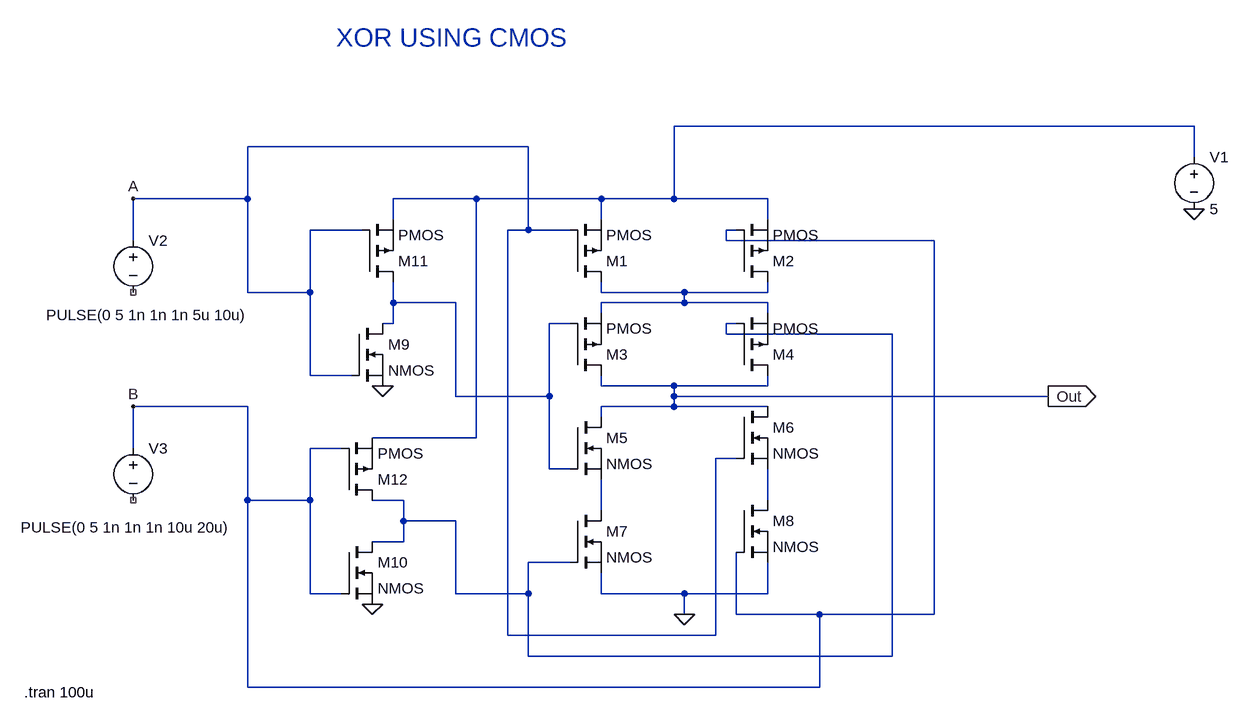
[diagram p0: schematic CMOS_XOR.asc]
CMOS_XOR.asc, the LTspice schematic file:
Version 4.1
SHEET 1 1224 744
WIRE 1168 -144 368 -144
WIRE 144 -112 -288 -112
WIRE 1168 -96 1168 -144
WIRE -288 -32 -288 -112
WIRE -288 -32 -464 -32
WIRE 64 -32 -64 -32
WIRE 256 -32 64 -32
WIRE 368 -32 368 -144
WIRE 368 -32 256 -32
WIRE 512 -32 368 -32
WIRE -64 0 -64 -32
WIRE 256 0 256 -32
WIRE 512 0 512 -32
WIRE -112 16 -192 16
WIRE 144 16 144 -112
WIRE 144 16 112 16
WIRE 208 16 144 16
WIRE 464 16 448 16
WIRE -464 32 -464 -32
WIRE 448 32 448 16
WIRE 768 32 448 32
WIRE -288 112 -288 -32
WIRE -192 112 -192 16
WIRE -192 112 -288 112
WIRE 256 112 256 96
WIRE 384 112 256 112
WIRE 512 112 512 96
WIRE 512 112 384 112
WIRE -64 128 -64 96
WIRE 32 128 -64 128
WIRE 384 128 384 112
WIRE 384 128 256 128
WIRE 512 128 384 128
WIRE 256 144 256 128
WIRE 512 144 512 128
WIRE -64 160 -64 128
WIRE -64 160 -80 160
WIRE 208 160 176 160
WIRE 464 160 448 160
WIRE 448 176 448 160
WIRE 704 176 448 176
WIRE -192 240 -192 112
WIRE -128 240 -192 240
WIRE 256 256 256 240
WIRE 368 256 256 256
WIRE 512 256 512 240
WIRE 512 256 368 256
WIRE 32 272 32 128
WIRE 176 272 176 160
WIRE 176 272 32 272
WIRE 368 272 368 256
WIRE 944 272 368 272
WIRE -288 288 -464 288
WIRE 368 288 368 272
WIRE 368 288 256 288
WIRE 512 288 368 288
WIRE 256 304 256 288
WIRE 64 336 64 -32
WIRE 64 336 -96 336
WIRE -464 352 -464 288
WIRE -144 352 -192 352
WIRE 464 368 432 368
WIRE 176 384 176 272
WIRE 208 384 176 384
WIRE -288 432 -288 288
WIRE -192 432 -192 352
WIRE -192 432 -288 432
WIRE -48 432 -96 432
WIRE 512 432 512 384
WIRE 256 448 256 400
WIRE -48 464 -48 432
WIRE 32 464 -48 464
WIRE -48 496 -48 464
WIRE -48 496 -96 496
WIRE 208 528 144 528
WIRE -192 576 -192 432
WIRE -144 576 -192 576
WIRE 32 576 32 464
WIRE 144 576 144 528
WIRE 144 576 32 576
WIRE 256 576 256 544
WIRE 384 576 256 576
WIRE 512 576 512 528
WIRE 512 576 384 576
WIRE 384 608 384 576
WIRE 464 608 464 512
WIRE 592 608 464 608
WIRE 768 608 768 32
WIRE 768 608 592 608
WIRE 112 640 112 16
WIRE 432 640 432 368
WIRE 432 640 112 640
WIRE 144 672 144 576
WIRE 704 672 704 176
WIRE 704 672 144 672
WIRE -288 720 -288 432
WIRE 592 720 592 608
WIRE 592 720 -288 720
FLAG 384 608 0
FLAG 944 272 Out
IOPIN 944 272 Out
FLAG 1168 -16 0
FLAG -80 256 0
FLAG -96 592 0
FLAG -464 -32 A
FLAG -464 288 B
SYMBOL pmos 208 96 M180
SYMATTR InstName M1
SYMBOL pmos 464 96 M180
SYMATTR InstName M2
SYMBOL pmos 208 240 M180
SYMATTR InstName M3
SYMBOL pmos 464 240 M180
SYMATTR InstName M4
SYMBOL nmos 208 304 R0
SYMATTR InstName M5
SYMBOL nmos 464 288 R0
SYMATTR InstName M6
SYMBOL nmos 208 448 R0
SYMATTR InstName M7
SYMBOL nmos 464 432 R0
SYMATTR InstName M8
SYMBOL voltage 1168 -112 R0
WINDOW 123 0 0 Left 0
WINDOW 39 0 0 Left 0
SYMATTR InstName V1
SYMATTR Value 5
SYMBOL voltage -464 16 R0
WINDOW 3 -134 131 Left 2
WINDOW 123 0 0 Left 0
WINDOW 39 0 0 Left 0
SYMATTR InstName V2
SYMATTR Value PULSE(0 5 1n 1n 1n 5u 10u)
SYMBOL voltage -464 336 R0
WINDOW 3 -173 138 Left 2
WINDOW 123 0 0 Left 0
WINDOW 39 0 0 Left 0
SYMATTR InstName V3
SYMATTR Value PULSE(0 5 1n 1n 1n 10u 20u)
SYMBOL nmos -128 160 R0
SYMATTR InstName M9
SYMBOL nmos -144 496 R0
SYMATTR InstName M10
SYMBOL pmos -112 96 M180
SYMATTR InstName M11
SYMBOL pmos -144 432 M180
SYMATTR InstName M12
TEXT -152 -280 Left 4 ;XOR USING CMOS
TEXT -632 728 Left 2 !.tran 100u

The netlist it stands for:
* CMOS_XOR.asc
M1 N002 A N001 N001 PMOS
M2 N002 B N001 N001 PMOS
M3 Out N003 N002 N002 PMOS
M4 Out N004 N002 N002 PMOS
M5 Out N003 N006 N006 NMOS
M6 Out A N005 N005 NMOS
M7 N006 N004 0 0 NMOS
M8 N005 B 0 0 NMOS
V1 N001 0 5
V2 A NC_01 PULSE(0 5 1n 1n 1n 5u 10u)
V3 B NC_02 PULSE(0 5 1n 1n 1n 10u 20u)
M9 N003 A 0 0 NMOS
M10 N004 B 0 0 NMOS
M11 N003 A N001 N001 PMOS
M12 N004 B N001 N001 PMOS
.model NMOS NMOS
.model PMOS PMOS
.lib standard.mos
* XOR USING CMOS
.tran 100u
.backanno
.end